# Altium schematic sheet switching_board.SchDoc
size A4; SheetNumber: 1; SheetTotal: 1
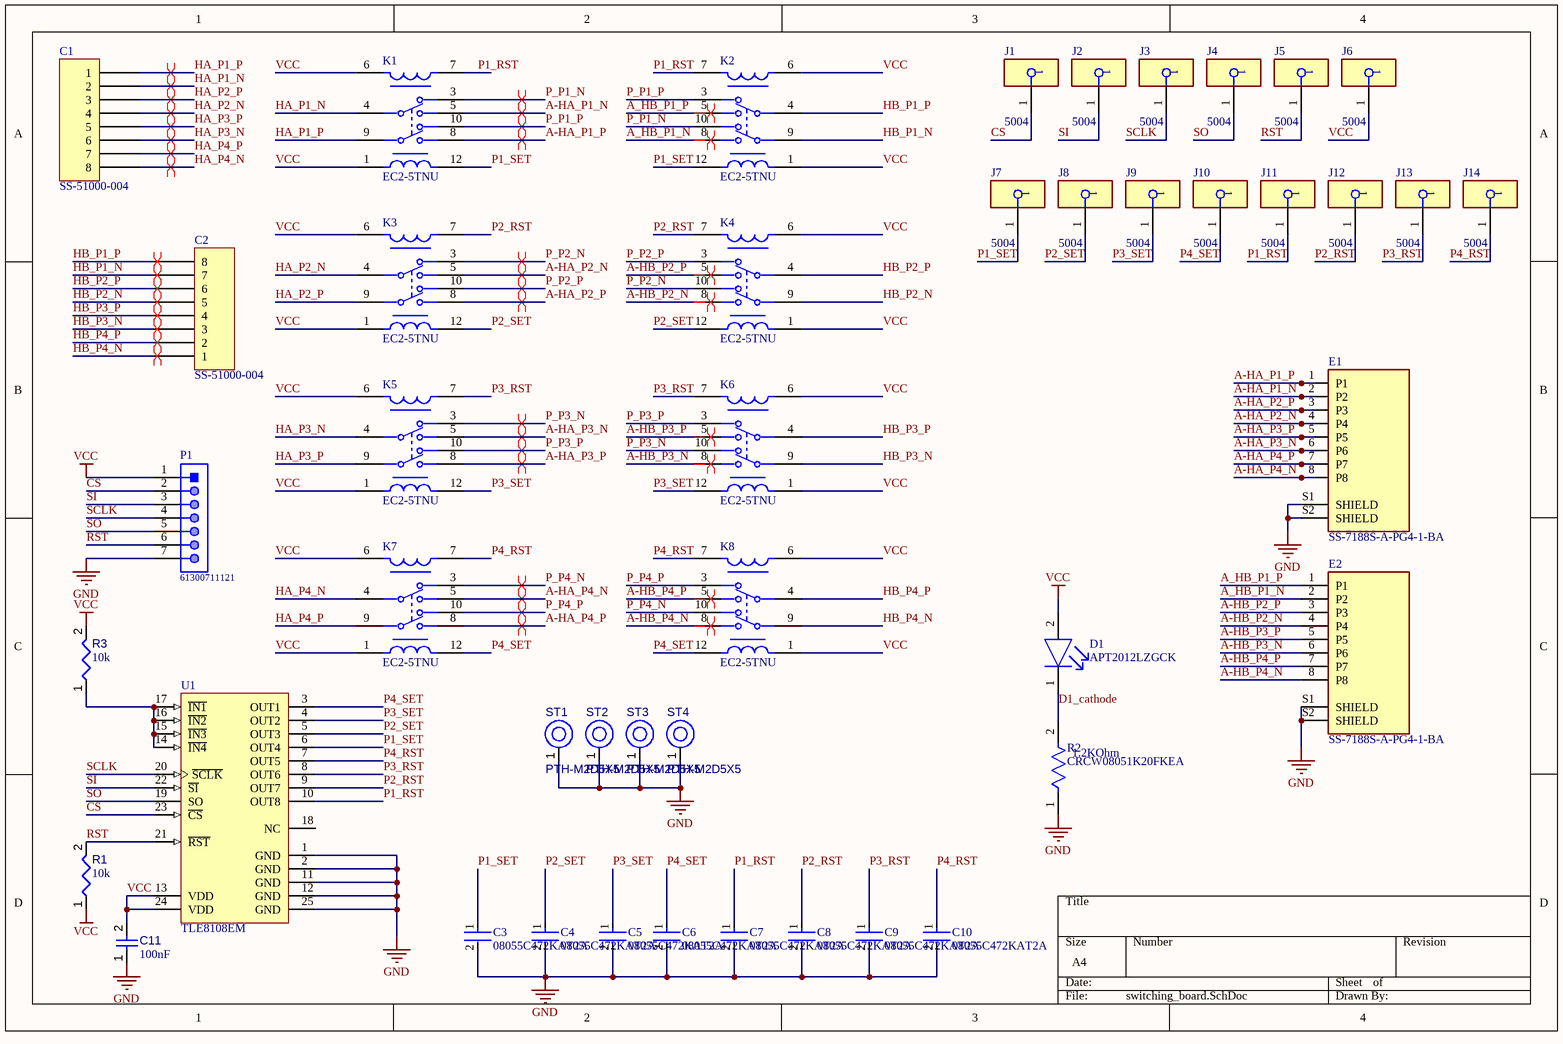
[diagram p0: switching_board.SchDoc]

## Parts
C1  SS-51000-004  [SS-51000-004-Footprint-1]
C2  SS-51000-004  [SS-51000-004-Footprint-1]
C3  08055C472KAT2A  [FP-0805-L_2_01_0_2-W_1_25-IPC_B]
C4  08055C472KAT2A  [FP-0805-L_2_01_0_2-W_1_25-IPC_B]
C5  08055C472KAT2A  [FP-0805-L_2_01_0_2-W_1_25-IPC_B]
C6  08055C472KAT2A  [FP-0805-L_2_01_0_2-W_1_25-IPC_B]
C7  08055C472KAT2A  [FP-0805-L_2_01_0_2-W_1_25-IPC_B]
C8  08055C472KAT2A  [FP-0805-L_2_01_0_2-W_1_25-IPC_B]
C9  08055C472KAT2A  [FP-0805-L_2_01_0_2-W_1_25-IPC_B]
C10  08055C472KAT2A  [FP-0805-L_2_01_0_2-W_1_25-IPC_B]
C11  value 100nF  [CAPC2013X95X50LL10T25]  (hidden comment: Capacitor 100 nF +/-10% 50 V 0805)
D1  APT2012LZGCK  [FP-APT2012LZGCK-MFG]
E1  SS-7188S-A-PG4-1-BA  [SS-7188S-A-PG4-1-BA-Footprint-1]
E2  SS-7188S-A-PG4-1-BA  [SS-7188S-A-PG4-1-BA-Footprint-1]
J1  5004  [FP-5004-MFG]
J2  5004  [FP-5004-MFG]
J3  5004  [FP-5004-MFG]
J4  5004  [FP-5004-MFG]
J5  5004  [FP-5004-MFG]
J6  5004  [FP-5004-MFG]
J7  5004  [FP-5004-MFG]
J8  5004  [FP-5004-MFG]
J9  5004  [FP-5004-MFG]
J10  5004  [FP-5004-MFG]
J11  5004  [FP-5004-MFG]
J12  5004  [FP-5004-MFG]
J13  5004  [FP-5004-MFG]
J14  5004  [FP-5004-MFG]
K1  EC2-5TNU  [FP-EC2-5TNU-MFG]
K2  EC2-5TNU  [FP-EC2-5TNU-MFG]
K3  EC2-5TNU  [FP-EC2-5TNU-MFG]
K4  EC2-5TNU  [FP-EC2-5TNU-MFG]
K5  EC2-5TNU  [FP-EC2-5TNU-MFG]
K6  EC2-5TNU  [FP-EC2-5TNU-MFG]
K7  EC2-5TNU  [FP-EC2-5TNU-MFG]
K8  EC2-5TNU  [FP-EC2-5TNU-MFG]
P1  61300711121  [61300711121]
R1  value 10k  [RESC2013X50X35ML15T15]  (hidden comment: Resistor 10k +/-1% 0805 125 mW)
R2  CRCW08051K20FKEA  [FP-CRCW0805-e3-MFG]
R3  value 10k  [RESC2013X50X35ML15T15]  (hidden comment: Resistor 10k +/-1% 0805 125 mW)
ST1  PTH-M2D5X5  [PTH-M2D5X5]
ST2  PTH-M2D5X5  [PTH-M2D5X5]
ST3  PTH-M2D5X5  [PTH-M2D5X5]
ST4  PTH-M2D5X5  [PTH-M2D5X5]
U1  TLE8108EM  [INF-PG-SSOP-24-4_L]

## Nets
GND: C3.2 C4.2 C5.2 C6.2 C7.2 C8.2 C9.2 C10.2 C11.1 E1.S1(SHIELD) E1.S2(SHIELD) E2.S1(SHIELD) E2.S2(SHIELD) P1.7 R2.1 ST1.1(H1) ST2.1(H1) ST3.1(H1) ST4.1(H1) U1.1(GND) U1.2(GND) U1.11(GND) U1.12(GND) U1.25(GND)
VCC: C11.2 D1.2(A) J6.1 K1.1(S+) K1.6(R+) K2.1(S+) K2.6(R+) K3.1(S+) K3.6(R+) K4.1(S+) K4.6(R+) K5.1(S+) K5.6(R+) K6.1(S+) K6.6(R+) K7.1(S+) K7.6(R+) K8.1(S+) K8.6(R+) P1.1 R1.1 R3.2 U1.13(VDD) U1.24(VDD)
A-HA_P1_N: E1.2(P2) K1.5
A-HA_P1_P: E1.1(P1) K1.8
A-HA_P2_N: E1.4(P4) K3.5
A-HA_P2_P: E1.3(P3) K3.8
A-HA_P3_N: E1.6(P6) K5.5
A-HA_P3_P: E1.5(P5) K5.8
A-HA_P4_N: E1.8(P8) K7.5
A-HA_P4_P: E1.7(P7) K7.8
A-HB_P2_N: E2.4(P4) K4.8
A-HB_P2_P: E2.3(P3) K4.5
A-HB_P3_N: E2.6(P6) K6.8
A-HB_P3_P: E2.5(P5) K6.5
A-HB_P4_N: E2.8(P8) K8.8
A-HB_P4_P: E2.7(P7) K8.5
A_HB_P1_N: E2.2(P2) K2.8
A_HB_P1_P: E2.1(P1) K2.5
CS: J1.1 P1.2 U1.23(~{CS})
D1_cathode: D1.1(C) R2.2
HA_P1_N: C1.2 K1.4
HA_P1_P: C1.1 K1.9
HA_P2_N: C1.4 K3.4
HA_P2_P: C1.3 K3.9
HA_P3_N: C1.6 K5.4
HA_P3_P: C1.5 K5.9
HA_P4_N: C1.8 K7.4
HA_P4_P: C1.7 K7.9
HB_P1_N: C2.7 K2.9
HB_P1_P: C2.8 K2.4
HB_P2_N: C2.5 K4.9
HB_P2_P: C2.6 K4.4
HB_P3_N: C2.3 K6.9
HB_P3_P: C2.4 K6.4
HB_P4_N: C2.1 K8.9
HB_P4_P: C2.2 K8.4
P1_RST: C7.1 J11.1 K1.7(R-) K2.7(R-) U1.10(OUT8)
P1_SET: C3.1 J7.1 K1.12(S-) K2.12(S-) U1.6(OUT4)
P2_RST: C8.1 J12.1 K3.7(R-) K4.7(R-) U1.9(OUT7)
P2_SET: C4.1 J8.1 K3.12(S-) K4.12(S-) U1.5(OUT3)
P3_RST: C9.1 J13.1 K5.7(R-) K6.7(R-) U1.8(OUT6)
P3_SET: C5.1 J9.1 K5.12(S-) K6.12(S-) U1.4(OUT2)
P4_RST: C10.1 J14.1 K7.7(R-) K8.7(R-) U1.7(OUT5)
P4_SET: C6.1 J10.1 K7.12(S-) K8.12(S-) U1.3(OUT1)
P_P1_N: K1.3 K2.10
P_P1_P: K1.10 K2.3
P_P2_N: K3.3 K4.10
P_P2_P: K3.10 K4.3
P_P3_N: K5.3 K6.10
P_P3_P: K5.10 K6.3
P_P4_N: K7.3 K8.10
P_P4_P: K7.10 K8.3
RST: J5.1 P1.6 R1.2 U1.21(~{RST})
SCLK: J3.1 P1.4 U1.20(~{SCLK})
SI: J2.1 P1.3 U1.22(~{SI})
SO: J4.1 P1.5 U1.19(SO)
NetR3_1: R3.1 U1.14(~{IN4}) U1.15(~{IN3}) U1.16(~{IN2}) U1.17(~{IN1})

Not connected (* = marked no-connect by the designer): U1 18(NC)

## Layout directives
differential pair: A-HA_P1_N, A-HA_P1_P, A-HA_P2_N, A-HA_P2_P, A-HA_P3_N, A-HA_P3_P, A-HA_P4_N, A-HA_P4_P, A-HB_P2_N, A-HB_P2_P, A-HB_P3_N, A-HB_P3_P, A-HB_P4_N, A-HB_P4_P, A_HB_P1_N, A_HB_P1_P, HA_P1_N, HA_P1_P, HA_P2_N, HA_P2_P, HA_P3_N, HA_P3_P, HA_P4_N, HA_P4_P, HB_P1_N, HB_P1_P, HB_P2_N, HB_P2_P, HB_P3_N, HB_P3_P, HB_P4_N, HB_P4_P, P_P1_N, P_P1_P, P_P2_N, P_P2_P, P_P3_N, P_P3_P, P_P4_N, P_P4_P

## Notes on the sheet
- (near R2) 1.2KOhm

## Library data of the parts
C1 C2 = CMP-002-00075-4: Stewart Connector, Internal Part #: SS-51000-004
C3-C10 = CMP-1036-03594-3: General Purpose Ceramic Capacitor, 0805, 4.7nF, 10%, X7R, 0.15, 50V; Dissipation Factor: 2.5%; Insulation Resistance: 100GR; Depth: 1.25mm; Width: 1.25mm; Construction: Flat; Series: -; Termination: SMD/SMT; Case Code (Imperial): 0805; Voltage Rating: 50V; Number of Pins: 2; Voltage Rating (DC): 50V; Dielectric Material: Ceramic; Capacitance: 4.7nF; Thickness: 0.037inch; Package Quantity: 1; Mount: Surface Mount; Voltage: 50V; Min Operating Temperature: -55°C; Size: 0.94mm; Packaging: Tape and Reel; Dielectric: X7R; RoHS Compliant: Yes; REACH SVHC: No SVHC; Tolerance: 10%; Length: 2.01mm; Lead Free: Lead Free; Radiation Hardening: No; Case/Package: 0805; Case Code (Metric): 2012; Max Operating Temperature: 125°C; Height: 0.94mm; Contact Plating: Tin
C11 = CMP-001-00018-6: Chip Capacitor, 100 nF, +/- 10%, 50 V, 0805 (2012 Metric); Capacitor Type: Ceramic; Voltage Rating: 50V; Pins: 2; Max Operating Temperature: 125°C; Min Operating Temperature: -55°C; Mounting Technology: SM; Case/Package: 0805; RoHS Compliant: True; Tolerance: 10%
D1 = CMP-44529-000065-1: LED GREEN CLEAR 2SMD; Lens Color: Colorless; Forward Voltage: 2.65V; Luminous Intensity: 50mcd; Viewing Angle: 120°; Test Current: 2mA; Dominant Wavelength: 525nm; Mount: Surface Mount; Case/Package: 0805; Lead Free: Lead Free; Packaging: Tape and Reel; Width: 1.25mm; Length: 2mm; Case Code (Imperial): 0805; Lens Transparency: Clear; Height: 0.75mm; Case Code (Metric): 2012; RoHS Compliant: Yes; Color: Green
E1 E2 = CMP-002-00072-1: Conn Modular Jack F 8 POS 1.27mm Solder RA Thru-Hole 8 Terminal 1 Port
J1-J14 = CMP-2000-05575-2: PC TEST POINT MINIATURE YELLOW; Manufacturer: Keystone; Number Of Contacts: 1; Is Female: yes; Device Class L1: Connectors; Manufacturer Part Number: 5004; Digikey Description: PC TEST POINT MINIATURE YELLOW; ComponentLink2URL: https://www.keyelco.com/product-pdf.cfm?p=1313; Lead Free: Yes; ComponentLink2Description: Datasheet; Category: Conn; Height: 4.72mm; Octopart: https://octopart.com/5004-keystone-28591; Mouser Description: TEST POINT PC MINI .040"D YELLOW; Device Class L3: unset; Contact Material: Silver; Package: 5004; Automotive: No; Device Class L2: unset; RoHS: TRUE
K1-K8 = CMP-03195-000012-1: RELAY GEN PURPOSE DPDT 2A 5VDC; Max Voltage Rating (AC): 250V; Operate Time: 2ms; Coil Current: 28mA; Max Voltage Rating (DC): 220V; Number of Poles: 1; Relay Type: General Purpose; Coil Resistance: 178R; Release Time: 1ms; Coil Power: 140mW; Coil Voltage (DC): 5V; Coil Type: Latching, Dual Coil; Contact Current Rating: 2A; Mount: Through Hole; Package Quantity: 35; RoHS Compliant: Yes; Contact Material: Gold; Termination: PC Pin; Current Rating: 2A; Number of Pins: 10; Length: 15mm; Min Operating Temperature: -40°C; Max Operating Temperature: 85°C; Radiation Hardening: No; REACH SVHC: No SVHC; Packaging: Rail/Tube; Max Current Rating: 2A; Throw Configuration: DPDT; Depth: 7.5mm; Height: 9.4mm; Power Consumption: 140mW
P1 = CMP-1502-01074-1: THT Vertical Pin Header WR-PHD, Pitch 2.54 mm, Single Row, 7 pins; Manufacturer: Wurth Elektronik; Pin Number: 7; Gender: Male; Working Voltage: 250VAC; Contact Resistance: 20mOhm; Rated Current: 3A; Pitch: 2.54mm; Withstanding Voltage: 500VAC; Row Number: Single; Packaging: Bag; Orientation: Vertical; Manufacturer URL: http://www.we-online.de; Datasheet URL: https://katalog.we-online.de/em/datasheet/6130xx11121.pdf; Part Number: 61300711121; Publisher: WurthElektronik; Operating Temperature: -40to105degC; Mounting Technology: THT; Package Reference: 61300711121
R1 R3 = CMP-009-00018-5: Chip Resistor, 10 KOhm, +/- 1%, 125 mW, -55 to 155 degC, 0805 (2012 Metric); Power: 125mW; Voltage Rating: 150V; Tolerance: 1%; Pins: 2; Min Operating Temperature: -55°C; Case/Package: 0805; Max Operating Temperature: 155°C; RoHS Compliant: True; Mounting Technology: SM
R2 = CMP-2001-03607-2: RES Thick Film, 1.2kΩ, 1%, 0.125W, 100ppm/°C, 0805; Max Power Dissipation: 125mW; Voltage Rating (DC): 150V; Resistance: 1.2kR; Military Standard: Not; Termination: SMD/SMT; Package Quantity: 10; Min Operating Temperature: -55°C; Weight: 0.000194oz; Width: 0.049inch; Voltage Rating: 150V; Temperature Coefficient: 100ppm/°C; Case Code (Imperial): 0805; Packaging: Tape and Reel; Composition: Thick Film; Lead Free: Lead Free; Number of Terminations: 2; Depth: 1.25mm; Power Rating: 125mW; Tolerance: 1%; Radiation Hardening: No; Length: 2mm; Case Code (Metric): 2012; Max Operating Temperature: 155°C; Height: 0.45mm; Features: Automotive AEC-Q200; Contact Plating: Tin; Case/Package: 0805
ST1-ST4 = CMP-00028-00004-2: M2 PTH (2.5mm), 5mm pad; Pins: 1
U1 = CMP-1097-00013-1: Smart 8 Channel Low Side Relay Driver with SPI Interface with Limitation Over-Current Protection, -40 to 150 degC, PG-SSOP-24-4, Reel, Green; Manufacturer: Infineon; VDD: 5 V; VDS(CL) (min): 41 V; VDS(CL): 45 V; ton (max): 50 us; Channels: 8; Green: TRUE; Thermal class: Exposed Pad; Over-Current Protection: Limitation; ComponentLink2URL: http://www.infineon.com/dgdl/TLE8108EM-v1.0-Data-Sheet.pdf?folderId=db3a30431400ef68011421b54e2e0564&fileId=db3a30433004641301302bf77ce863a2&sId=db3a30443d67b5ca013d7df33535290c; ComponentLink3URL: http://www.infineon.com/dgdl/TLE8088EM_DS_10.pdf?folderId=db3a30431b3e89eb011bb632994f065b&fileId=db3a30433a047ba0013a446e76be0bbb&location=en.Products.Automotive_ICs.Powertrain_ICs.Power_Interface_Products_for_Motorcycle_and_Small_Engines.DATASHEET.TLE808; ComponentLink1URL: http://www.infineon.com/; ComponentLink2Description: Datasheet; PartNumber: TLE8108EM; ComponentLink1Description: Manufacturer URL; PackageVersion: Oct-12; PackageDescription: 24-Pin Plastic (Green) Shrink Small Outline Package, 8.65 x 3.9 mm Body, 0.65 mm Pitch; PackageReference: PG-SSOP-24-4; Mounting Technology: Surface Mount; Packing: Reel; ComponentLink3Description: Package Specification; DatasheetVersion: Rev. 1.0; toff (max): 50 us; Halogen-free: TRUE